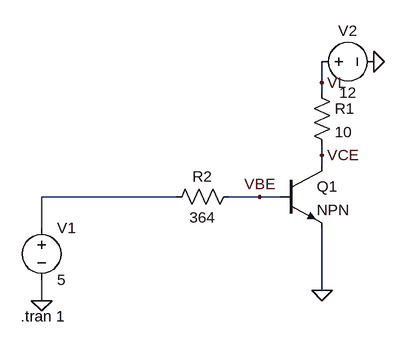
[diagram p0: schematic circuito4.asc]
circuito4.asc, the LTspice schematic file:
Version 4.1
SHEET 1 880 680
WIRE 464 -80 464 -112
WIRE 464 -64 464 -80
WIRE 464 32 464 16
WIRE 464 48 464 32
WIRE 240 96 32 96
WIRE 368 96 320 96
WIRE 400 96 368 96
WIRE 32 144 32 96
WIRE 464 240 464 144
WIRE 32 256 32 224
FLAG 544 -112 0
FLAG 464 240 0
FLAG 32 256 0
FLAG 368 96 VBE
FLAG 464 32 VCE
FLAG 464 -80 VL
SYMBOL voltage 32 128 R0
WINDOW 123 0 0 Left 0
WINDOW 39 0 0 Left 0
SYMATTR InstName V1
SYMATTR Value 5
SYMBOL voltage 448 -112 R270
WINDOW 0 32 56 VTop 2
WINDOW 3 -32 56 VBottom 2
WINDOW 123 0 0 Left 0
WINDOW 39 0 0 Left 0
SYMATTR InstName V2
SYMATTR Value 12
SYMBOL npn 400 48 R0
SYMATTR InstName Q1
SYMBOL res 448 -80 R0
SYMATTR InstName R1
SYMATTR Value 10
SYMBOL res 336 80 R90
WINDOW 0 0 56 VBottom 2
WINDOW 3 32 56 VTop 2
SYMATTR InstName R2
SYMATTR Value 364
TEXT 0 280 Left 2 !.tran 1

The netlist it stands for:
* circuito4.asc
V1 N001 0 5
V2 VL 0 12
Q1 VCE VBE 0 0 NPN
R1 VL VCE 10
R2 VBE N001 364
.model NPN NPN
.model PNP PNP
.lib standard.bjt
.tran 1
.backanno
.end